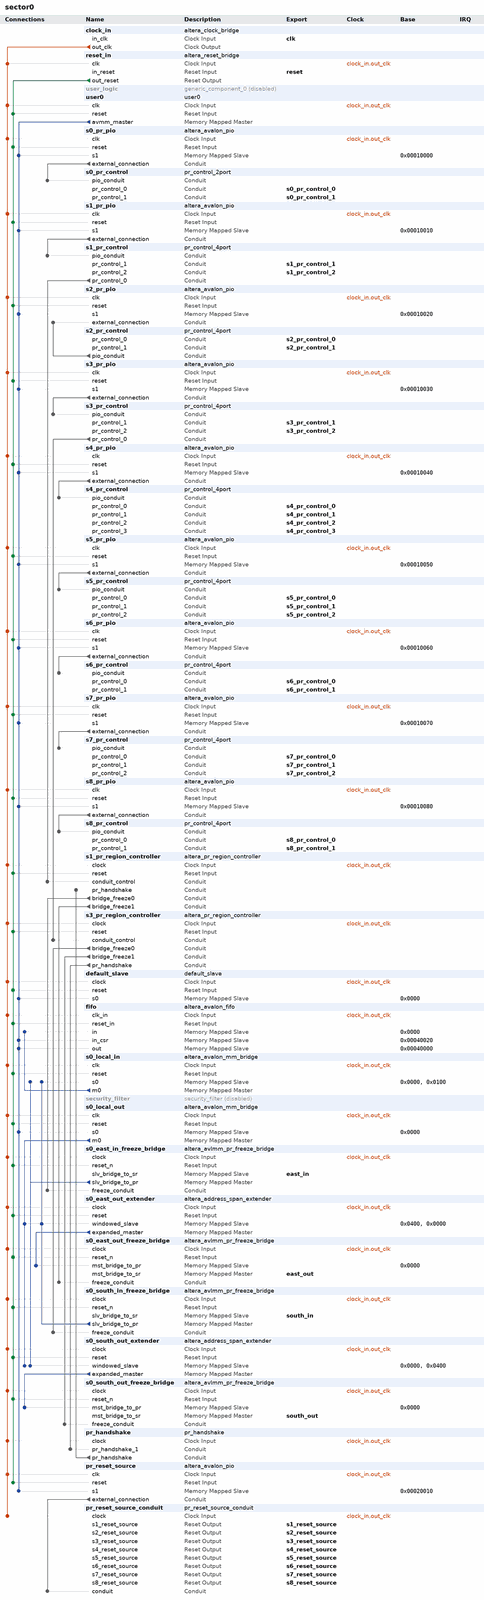
[diagram p0: system contents, whole]
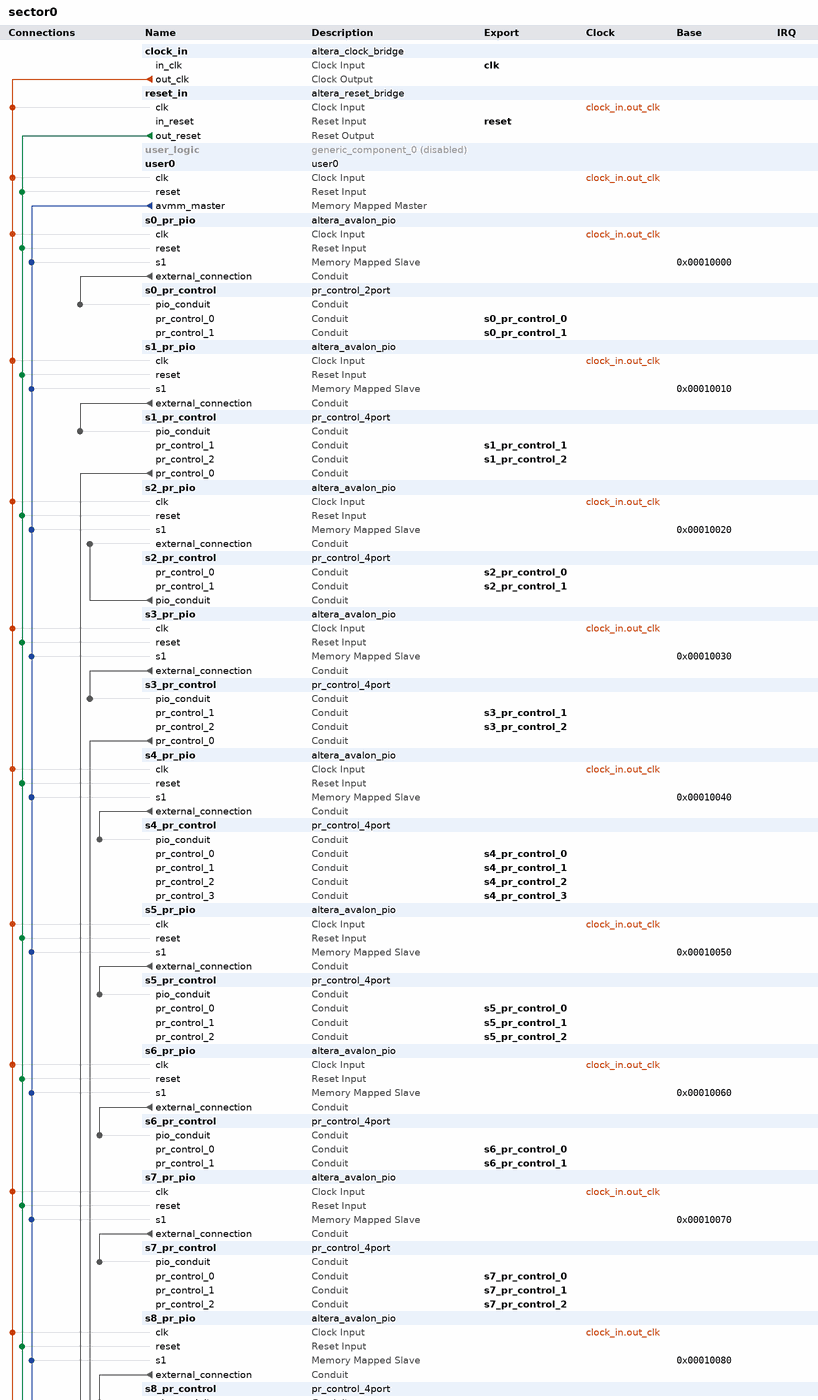
[diagram p1: system contents, upper part]
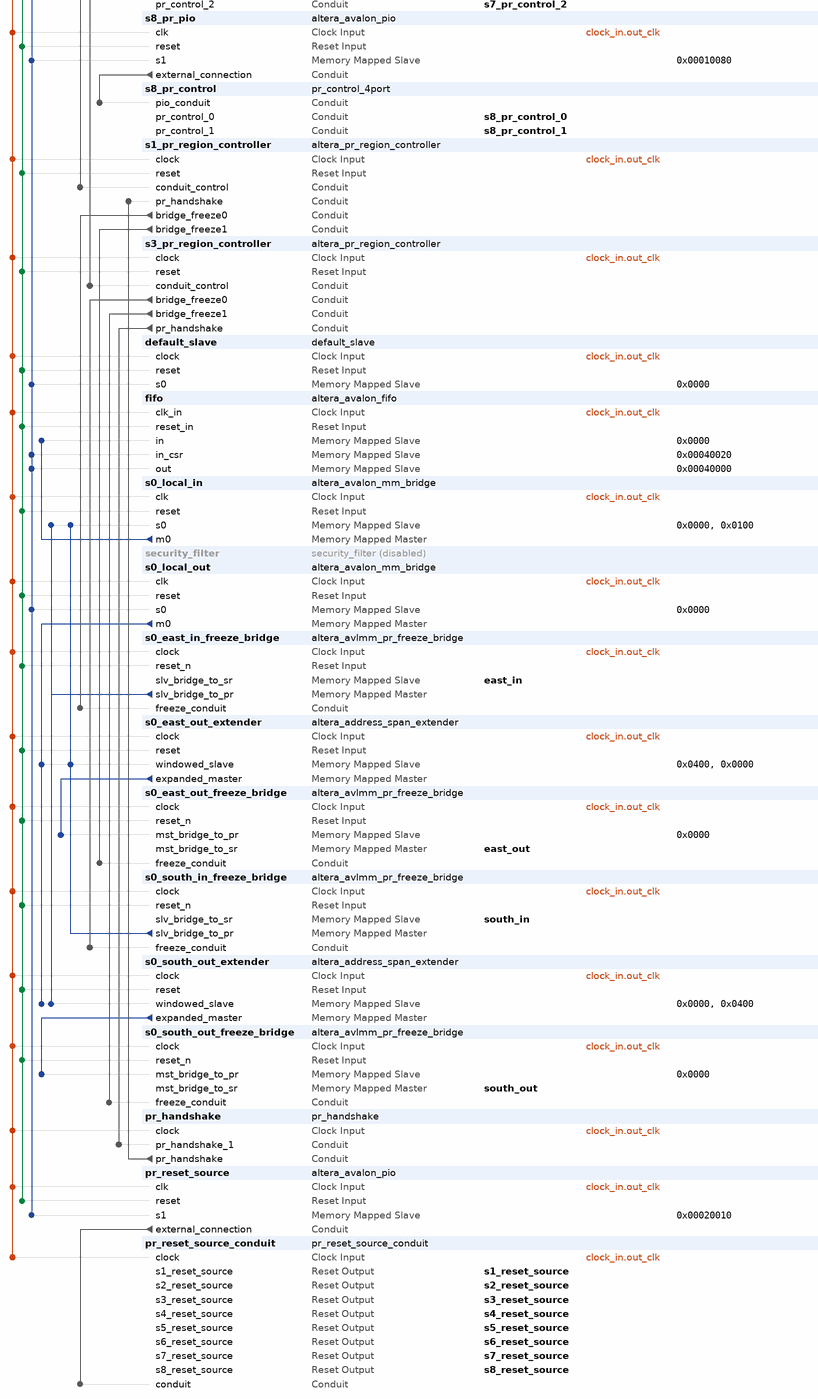
[diagram p2: system contents, lower part]
# Platform Designer (Qsys) system sector0, Stratix 10 1SG280HU2F50E2VGS1
# Parameters at their usual value, and those the tool derives, are not listed.
package require -exact qsys 1.0
create_system sector0
set_project_property DEVICE_FAMILY {Stratix 10}
set_project_property DEVICE 1SG280HU2F50E2VGS1

add_component clock_in ip/sector0/sector0_clock_in.ip altera_clock_bridge clock_in 18.0
load_component clock_in
set_component_parameter_value DERIVED_CLOCK_RATE 50000000
set_component_parameter_value EXPLICIT_CLOCK_RATE 50000000
save_component

add_component reset_in ip/sector0/sector0_reset_in.ip altera_reset_bridge reset_in 18.0
load_component reset_in
set_component_parameter_value ACTIVE_LOW_RESET 0
set_component_parameter_value SYNCHRONOUS_EDGES deassert
set_component_parameter_value SYNC_RESET 0
save_component

add_component user_logic {} generic_component_0 user_logic 1.0
set_instance_property user_logic ENABLED false

add_component user0 user0.qsys user0 user0 

add_component s0_pr_pio ip/sector0/sector0_pio_0.ip altera_avalon_pio s0_pr_pio 18.0
load_component s0_pr_pio
set_component_parameter_value direction InOut
set_component_parameter_value width 8
save_component

add_component s0_pr_control ip/sector0/sector0_pr_control_2port_0.ip pr_control_2port s0_pr_control 1.0

add_component s1_pr_pio ip/sector0/sector0_pio_1.ip altera_avalon_pio s1_pr_pio 18.0
load_component s1_pr_pio
set_component_parameter_value direction InOut
set_component_parameter_value width 16
save_component

add_component s1_pr_control ip/sector0/sector0_pr_control_4port_2.ip pr_control_4port s1_pr_control 1.0

add_component s2_pr_pio ip/sector0/sector0_pio_2.ip altera_avalon_pio s2_pr_pio 18.0
load_component s2_pr_pio
set_component_parameter_value direction InOut
set_component_parameter_value width 16
save_component

add_component s2_pr_control ip/sector0/sector0_pr_control_4port_3.ip pr_control_4port s2_pr_control 1.0

add_component s3_pr_pio ip/sector0/sector0_pio_3.ip altera_avalon_pio s3_pr_pio 18.0
load_component s3_pr_pio
set_component_parameter_value direction InOut
set_component_parameter_value width 16
save_component

add_component s3_pr_control ip/sector0/sector0_pr_control_4port_1.ip pr_control_4port s3_pr_control 1.0

add_component s4_pr_pio ip/sector0/sector0_pio_4.ip altera_avalon_pio s4_pr_pio 18.0
load_component s4_pr_pio
set_component_parameter_value direction InOut
set_component_parameter_value width 16
save_component

add_component s4_pr_control ip/sector0/sector0_pr_control_4port_0.ip pr_control_4port s4_pr_control 1.0

add_component s5_pr_pio ip/sector0/sector0_pio_5.ip altera_avalon_pio s5_pr_pio 18.0
load_component s5_pr_pio
set_component_parameter_value direction InOut
set_component_parameter_value width 16
save_component

add_component s5_pr_control ip/sector0/sector0_pr_control_4port_4.ip pr_control_4port s5_pr_control 1.0

add_component s6_pr_pio ip/sector0/sector0_pio_6.ip altera_avalon_pio s6_pr_pio 18.0
load_component s6_pr_pio
set_component_parameter_value direction InOut
set_component_parameter_value width 16
save_component

add_component s6_pr_control ip/sector0/sector0_pr_control_4port_5.ip pr_control_4port s6_pr_control 1.0

add_component s7_pr_pio ip/sector0/sector0_pio_7.ip altera_avalon_pio s7_pr_pio 18.0
load_component s7_pr_pio
set_component_parameter_value direction InOut
set_component_parameter_value width 16
save_component

add_component s7_pr_control ip/sector0/sector0_pr_control_4port_6.ip pr_control_4port s7_pr_control 1.0

add_component s8_pr_pio ip/sector0/sector0_pio_8.ip altera_avalon_pio s8_pr_pio 18.0
load_component s8_pr_pio
set_component_parameter_value direction InOut
set_component_parameter_value width 16
save_component

add_component s8_pr_control ip/sector0/sector0_pr_control_4port_7.ip pr_control_4port s8_pr_control 1.0

add_component s1_pr_region_controller ip/sector0/sector0_pr_region_controller_0.ip altera_pr_region_controller s1_pr_region_controller 18.0
load_component s1_pr_region_controller
set_component_parameter_value ENABLE_CSR false
set_component_parameter_value ENABLE_IRQ false
set_component_parameter_value NUM_INTF_BRIDGE 2
set_component_parameter_value ENABLE_PR_REGION_FREEZE false
set_component_parameter_value NUM_PR_REGION_RAM 1
save_component

add_component s3_pr_region_controller ip/sector0/sector0_pr_region_controller_1.ip altera_pr_region_controller s3_pr_region_controller 18.0
load_component s3_pr_region_controller
set_component_parameter_value ENABLE_CSR false
set_component_parameter_value ENABLE_IRQ false
set_component_parameter_value NUM_INTF_BRIDGE 2
set_component_parameter_value ENABLE_PR_REGION_FREEZE false
set_component_parameter_value NUM_PR_REGION_RAM 1
save_component

add_component default_slave ip/sector0/sector0_default_slave_0.ip default_slave default_slave 1.0

add_component fifo ip/sector0/sector0_fifo_0.ip altera_avalon_fifo fifo 18.0
load_component fifo
set_component_parameter_value bitsPerSymbol 16
set_component_parameter_value channelWidth 8
set_component_parameter_value errorWidth 8
set_component_parameter_value fifoDepth 16
set_component_parameter_value fifoInputInterfaceOptions AVALONMM_WRITE
set_component_parameter_value fifoOutputInterfaceOptions AVALONMM_READ
set_component_parameter_value singleClockMode true
set_component_parameter_value symbolsPerBeat 2
set_component_parameter_value useIRQ false
set_component_parameter_value usePacket true
set_component_parameter_value useReadControl false
save_component

add_component s0_local_in ip/sector0/s0_local_in.ip altera_avalon_mm_bridge s0_local_in 18.0
load_component s0_local_in
set_component_parameter_value DATA_WIDTH 32
set_component_parameter_value ADDRESS_WIDTH 4
set_component_parameter_value USE_AUTO_ADDRESS_WIDTH 0
set_component_parameter_value ADDRESS_UNITS SYMBOLS
set_component_parameter_value MAX_PENDING_RESPONSES 4
set_component_parameter_value SYNC_RESET 0
save_component

add_component security_filter ip/sector0/sector0_security_filter_0.ip security_filter security_filter 0
load_component security_filter
set_instance_property security_filter ENABLED false
set_component_parameter_value SECTOR_ADDR_SIZE 4
set_component_parameter_value AVMM_ADDR_SIZE 16
set_component_parameter_value DATA_SIZE 32
set_component_parameter_value DROP_ADDR 255
set_component_parameter_value S0_ADDR 255
set_component_parameter_value S1_ADDR 32768
set_component_parameter_value S2_ADDR 36864
set_component_parameter_value S3_ADDR 24576
set_component_parameter_value S4_ADDR 16384
set_component_parameter_value S5_ADDR 20480
set_component_parameter_value S6_ADDR 0
set_component_parameter_value S7_ADDR 8192
set_component_parameter_value S8_ADDR 12288
save_component

add_component s0_local_out ip/sector0/s0_local_out.ip altera_avalon_mm_bridge s0_local_out 18.0
load_component s0_local_out
set_component_parameter_value DATA_WIDTH 32
set_component_parameter_value ADDRESS_WIDTH 16
set_component_parameter_value USE_AUTO_ADDRESS_WIDTH 0
set_component_parameter_value ADDRESS_UNITS SYMBOLS
set_component_parameter_value MAX_PENDING_RESPONSES 4
set_component_parameter_value SYNC_RESET 0
save_component

add_component s0_east_in_freeze_bridge ip/sector0/sector0_avlmm_pr_freeze_bridge_0.ip altera_avlmm_pr_freeze_bridge s0_east_in_freeze_bridge 18.0
load_component s0_east_in_freeze_bridge
set_component_parameter_value Interface_Type {Avalon-MM Slave}
set_component_parameter_value ENABLE_FREEZE_FROM_PR_REGION false
set_component_parameter_value ENABLE_TRAFFIC_TRACKING false
set_component_parameter_value slv_bridge_signal_name_DERIVED address,beginbursttransfer,byteenable,debugaccess,read,write,readdata,writedata,waitrequest,readdatavalid,burstcount,response,lock,writeresponsevalid
set_component_parameter_value slv_bridge_signal_Enable Yes,No,Yes,No,Yes,Yes,Yes,Yes,Yes,Yes,No,No,No,No
set_component_parameter_value SLV_BRIDGE_ADDR_WIDTH 20
set_component_parameter_value SLV_BRIDGE_SYMBOL_WIDTH 8
set_component_parameter_value SLV_BRIDGE_BYTEEN_WIDTH 4
set_component_parameter_value SLV_BRIDGE_BURSTCOUNT_WIDTH 3
set_component_parameter_value SLV_BRIDGE_BURST_LINEWRAP false
set_component_parameter_value SLV_BRIDGE_CONSTANTBURSTBEHAVIOR false
set_component_parameter_value SLV_BRIDGE_BURST_BNDR_ONLY false
set_component_parameter_value SLV_BRIDGE_MAX_PENDING_READS 1
set_component_parameter_value SLV_BRIDGE_MAX_PENDING_WRITES 0
set_component_parameter_value SLV_BRIDGE_FIX_READ_LATENCY 0
set_component_parameter_value SLV_BRIDGE_READ_WAIT_TIME 1
set_component_parameter_value SLV_BRIDGE_WRITE_WAIT_TIME 0
set_component_parameter_value SLV_BRIDGE_ADDRESS_UNITS SYMBOLS
set_component_parameter_value mst_bridge_signal_name_DERIVED address,beginbursttransfer,byteenable,debugaccess,read,write,readdata,writedata,waitrequest,readdatavalid,burstcount,response,lock,writeresponsevalid
set_component_parameter_value mst_bridge_signal_Enable Yes,Yes,Yes,Yes,Yes,Yes,Yes,Yes,Yes,Yes,Yes,Yes,Yes,Yes
set_component_parameter_value MST_BRIDGE_ADDR_WIDTH 32
set_component_parameter_value MST_BRIDGE_SYMBOL_WIDTH 8
set_component_parameter_value MST_BRIDGE_BYTEEN_WIDTH 4
set_component_parameter_value MST_BRIDGE_BURSTCOUNT_WIDTH 3
set_component_parameter_value MST_BRIDGE_BURST_LINEWRAP true
set_component_parameter_value MST_BRIDGE_BURST_BNDR_ONLY true
set_component_parameter_value MST_BRIDGE_CONSTANTBURSTBEHAVIOR true
set_component_parameter_value MST_BRIDGE_MAX_PENDING_READS 1
set_component_parameter_value MST_BRIDGE_MAX_PENDING_WRITES 1
set_component_parameter_value MST_BRIDGE_FIX_READ_LATENCY 0
set_component_parameter_value MST_BRIDGE_READ_WAIT_TIME 1
set_component_parameter_value MST_BRIDGE_WRITE_WAIT_TIME 0
set_component_parameter_value MST_BRIDGE_ADDRESS_UNITS SYMBOLS
save_component

add_component s0_east_out_extender ip/sector0/s0_east_out_extender.ip altera_address_span_extender s0_east_out_extender 18.0
load_component s0_east_out_extender
set_component_parameter_value DATA_WIDTH 32
set_component_parameter_value MASTER_ADDRESS_WIDTH 20
set_component_parameter_value SLAVE_ADDRESS_WIDTH 6
set_component_parameter_value BURSTCOUNT_WIDTH 1
set_component_parameter_value MASTER_ADDRESS_DEF 0
set_component_parameter_value ENABLE_SLAVE_PORT false
set_component_parameter_value MAX_PENDING_READS 4
set_component_parameter_value SYNC_RESET 0
save_component

add_component s0_east_out_freeze_bridge ip/sector0/sector0_avlmm_pr_freeze_bridge_1.ip altera_avlmm_pr_freeze_bridge s0_east_out_freeze_bridge 18.0
load_component s0_east_out_freeze_bridge
set_component_parameter_value Interface_Type {Avalon-MM Master}
set_component_parameter_value ENABLE_FREEZE_FROM_PR_REGION false
set_component_parameter_value ENABLE_TRAFFIC_TRACKING false
set_component_parameter_value slv_bridge_signal_name_DERIVED address,beginbursttransfer,byteenable,debugaccess,read,write,readdata,writedata,waitrequest,readdatavalid,burstcount,response,lock,writeresponsevalid
set_component_parameter_value slv_bridge_signal_Enable Yes,Yes,Yes,Yes,Yes,Yes,Yes,Yes,Yes,Yes,Yes,Yes,Yes,Yes
set_component_parameter_value SLV_BRIDGE_ADDR_WIDTH 32
set_component_parameter_value SLV_BRIDGE_SYMBOL_WIDTH 8
set_component_parameter_value SLV_BRIDGE_BYTEEN_WIDTH 4
set_component_parameter_value SLV_BRIDGE_BURSTCOUNT_WIDTH 3
set_component_parameter_value SLV_BRIDGE_BURST_LINEWRAP true
set_component_parameter_value SLV_BRIDGE_CONSTANTBURSTBEHAVIOR true
set_component_parameter_value SLV_BRIDGE_BURST_BNDR_ONLY true
set_component_parameter_value SLV_BRIDGE_MAX_PENDING_READS 1
set_component_parameter_value SLV_BRIDGE_MAX_PENDING_WRITES 1
set_component_parameter_value SLV_BRIDGE_FIX_READ_LATENCY 0
set_component_parameter_value SLV_BRIDGE_READ_WAIT_TIME 1
set_component_parameter_value SLV_BRIDGE_WRITE_WAIT_TIME 0
set_component_parameter_value SLV_BRIDGE_ADDRESS_UNITS SYMBOLS
set_component_parameter_value mst_bridge_signal_name_DERIVED address,beginbursttransfer,byteenable,debugaccess,read,write,readdata,writedata,waitrequest,readdatavalid,burstcount,response,lock,writeresponsevalid
set_component_parameter_value mst_bridge_signal_Enable Yes,No,Yes,No,Yes,Yes,Yes,Yes,Yes,Yes,No,No,No,No
set_component_parameter_value MST_BRIDGE_ADDR_WIDTH 20
set_component_parameter_value MST_BRIDGE_SYMBOL_WIDTH 8
set_component_parameter_value MST_BRIDGE_BYTEEN_WIDTH 4
set_component_parameter_value MST_BRIDGE_BURSTCOUNT_WIDTH 3
set_component_parameter_value MST_BRIDGE_BURST_LINEWRAP false
set_component_parameter_value MST_BRIDGE_BURST_BNDR_ONLY false
set_component_parameter_value MST_BRIDGE_CONSTANTBURSTBEHAVIOR false
set_component_parameter_value MST_BRIDGE_MAX_PENDING_READS 1
set_component_parameter_value MST_BRIDGE_MAX_PENDING_WRITES 0
set_component_parameter_value MST_BRIDGE_FIX_READ_LATENCY 0
set_component_parameter_value MST_BRIDGE_READ_WAIT_TIME 1
set_component_parameter_value MST_BRIDGE_WRITE_WAIT_TIME 0
set_component_parameter_value MST_BRIDGE_ADDRESS_UNITS SYMBOLS
save_component

add_component s0_south_in_freeze_bridge ip/sector0/sector0_avlmm_pr_freeze_bridge_2.ip altera_avlmm_pr_freeze_bridge s0_south_in_freeze_bridge 18.0
load_component s0_south_in_freeze_bridge
set_component_parameter_value Interface_Type {Avalon-MM Slave}
set_component_parameter_value ENABLE_FREEZE_FROM_PR_REGION false
set_component_parameter_value ENABLE_TRAFFIC_TRACKING false
set_component_parameter_value slv_bridge_signal_name_DERIVED address,beginbursttransfer,byteenable,debugaccess,read,write,readdata,writedata,waitrequest,readdatavalid,burstcount,response,lock,writeresponsevalid
set_component_parameter_value slv_bridge_signal_Enable Yes,No,Yes,No,Yes,Yes,Yes,Yes,Yes,Yes,No,No,No,No
set_component_parameter_value SLV_BRIDGE_ADDR_WIDTH 20
set_component_parameter_value SLV_BRIDGE_SYMBOL_WIDTH 8
set_component_parameter_value SLV_BRIDGE_BYTEEN_WIDTH 4
set_component_parameter_value SLV_BRIDGE_BURSTCOUNT_WIDTH 3
set_component_parameter_value SLV_BRIDGE_BURST_LINEWRAP false
set_component_parameter_value SLV_BRIDGE_CONSTANTBURSTBEHAVIOR false
set_component_parameter_value SLV_BRIDGE_BURST_BNDR_ONLY false
set_component_parameter_value SLV_BRIDGE_MAX_PENDING_READS 1
set_component_parameter_value SLV_BRIDGE_MAX_PENDING_WRITES 0
set_component_parameter_value SLV_BRIDGE_FIX_READ_LATENCY 0
set_component_parameter_value SLV_BRIDGE_READ_WAIT_TIME 1
set_component_parameter_value SLV_BRIDGE_WRITE_WAIT_TIME 0
set_component_parameter_value SLV_BRIDGE_ADDRESS_UNITS SYMBOLS
set_component_parameter_value mst_bridge_signal_name_DERIVED address,beginbursttransfer,byteenable,debugaccess,read,write,readdata,writedata,waitrequest,readdatavalid,burstcount,response,lock,writeresponsevalid
set_component_parameter_value mst_bridge_signal_Enable Yes,Yes,Yes,Yes,Yes,Yes,Yes,Yes,Yes,Yes,Yes,Yes,Yes,Yes
set_component_parameter_value MST_BRIDGE_ADDR_WIDTH 32
set_component_parameter_value MST_BRIDGE_SYMBOL_WIDTH 8
set_component_parameter_value MST_BRIDGE_BYTEEN_WIDTH 4
set_component_parameter_value MST_BRIDGE_BURSTCOUNT_WIDTH 3
set_component_parameter_value MST_BRIDGE_BURST_LINEWRAP true
set_component_parameter_value MST_BRIDGE_BURST_BNDR_ONLY true
set_component_parameter_value MST_BRIDGE_CONSTANTBURSTBEHAVIOR true
set_component_parameter_value MST_BRIDGE_MAX_PENDING_READS 1
set_component_parameter_value MST_BRIDGE_MAX_PENDING_WRITES 1
set_component_parameter_value MST_BRIDGE_FIX_READ_LATENCY 0
set_component_parameter_value MST_BRIDGE_READ_WAIT_TIME 1
set_component_parameter_value MST_BRIDGE_WRITE_WAIT_TIME 0
set_component_parameter_value MST_BRIDGE_ADDRESS_UNITS SYMBOLS
save_component

add_component s0_south_out_extender ip/sector0/s0_south_out_extender.ip altera_address_span_extender s0_south_out_extender 18.0
load_component s0_south_out_extender
set_component_parameter_value DATA_WIDTH 32
set_component_parameter_value MASTER_ADDRESS_WIDTH 20
set_component_parameter_value SLAVE_ADDRESS_WIDTH 8
set_component_parameter_value BURSTCOUNT_WIDTH 1
set_component_parameter_value MASTER_ADDRESS_DEF 0
set_component_parameter_value ENABLE_SLAVE_PORT false
set_component_parameter_value MAX_PENDING_READS 4
set_component_parameter_value SYNC_RESET 0
save_component

add_component s0_south_out_freeze_bridge ip/sector0/sector0_avlmm_pr_freeze_bridge_3.ip altera_avlmm_pr_freeze_bridge s0_south_out_freeze_bridge 18.0
load_component s0_south_out_freeze_bridge
set_component_parameter_value Interface_Type {Avalon-MM Master}
set_component_parameter_value ENABLE_FREEZE_FROM_PR_REGION false
set_component_parameter_value ENABLE_TRAFFIC_TRACKING false
set_component_parameter_value slv_bridge_signal_name_DERIVED address,beginbursttransfer,byteenable,debugaccess,read,write,readdata,writedata,waitrequest,readdatavalid,burstcount,response,lock,writeresponsevalid
set_component_parameter_value slv_bridge_signal_Enable Yes,Yes,Yes,Yes,Yes,Yes,Yes,Yes,Yes,Yes,Yes,Yes,Yes,Yes
set_component_parameter_value SLV_BRIDGE_ADDR_WIDTH 32
set_component_parameter_value SLV_BRIDGE_SYMBOL_WIDTH 8
set_component_parameter_value SLV_BRIDGE_BYTEEN_WIDTH 4
set_component_parameter_value SLV_BRIDGE_BURSTCOUNT_WIDTH 3
set_component_parameter_value SLV_BRIDGE_BURST_LINEWRAP true
set_component_parameter_value SLV_BRIDGE_CONSTANTBURSTBEHAVIOR true
set_component_parameter_value SLV_BRIDGE_BURST_BNDR_ONLY true
set_component_parameter_value SLV_BRIDGE_MAX_PENDING_READS 1
set_component_parameter_value SLV_BRIDGE_MAX_PENDING_WRITES 1
set_component_parameter_value SLV_BRIDGE_FIX_READ_LATENCY 0
set_component_parameter_value SLV_BRIDGE_READ_WAIT_TIME 1
set_component_parameter_value SLV_BRIDGE_WRITE_WAIT_TIME 0
set_component_parameter_value SLV_BRIDGE_ADDRESS_UNITS SYMBOLS
set_component_parameter_value mst_bridge_signal_name_DERIVED address,beginbursttransfer,byteenable,debugaccess,read,write,readdata,writedata,waitrequest,readdatavalid,burstcount,response,lock,writeresponsevalid
set_component_parameter_value mst_bridge_signal_Enable Yes,No,Yes,No,Yes,Yes,Yes,Yes,Yes,Yes,No,No,No,No
set_component_parameter_value MST_BRIDGE_ADDR_WIDTH 20
set_component_parameter_value MST_BRIDGE_SYMBOL_WIDTH 8
set_component_parameter_value MST_BRIDGE_BYTEEN_WIDTH 4
set_component_parameter_value MST_BRIDGE_BURSTCOUNT_WIDTH 3
set_component_parameter_value MST_BRIDGE_BURST_LINEWRAP false
set_component_parameter_value MST_BRIDGE_BURST_BNDR_ONLY false
set_component_parameter_value MST_BRIDGE_CONSTANTBURSTBEHAVIOR false
set_component_parameter_value MST_BRIDGE_MAX_PENDING_READS 1
set_component_parameter_value MST_BRIDGE_MAX_PENDING_WRITES 0
set_component_parameter_value MST_BRIDGE_FIX_READ_LATENCY 0
set_component_parameter_value MST_BRIDGE_READ_WAIT_TIME 1
set_component_parameter_value MST_BRIDGE_WRITE_WAIT_TIME 0
set_component_parameter_value MST_BRIDGE_ADDRESS_UNITS SYMBOLS
save_component

add_component pr_handshake ip/sector0/sector0_pr_handshake_0.ip pr_handshake pr_handshake 1.0

add_component pr_reset_source ip/sector0/sector0_pio_9.ip altera_avalon_pio pr_reset_source 18.0
load_component pr_reset_source
set_component_parameter_value direction Output
set_component_parameter_value width 9
save_component

add_component pr_reset_source_conduit ip/sector0/sector0_pr_reset_source_conduit_0.ip pr_reset_source_conduit pr_reset_source_conduit 1.0

# connections
add_connection clock_in.out_clk default_slave.clock clock
add_connection clock_in.out_clk fifo.clk_in clock
add_connection clock_in.out_clk pr_handshake.clock clock
add_connection clock_in.out_clk pr_reset_source.clk clock
add_connection clock_in.out_clk pr_reset_source_conduit.clock clock
add_connection clock_in.out_clk reset_in.clk clock
add_connection clock_in.out_clk s0_east_in_freeze_bridge.clock clock
add_connection clock_in.out_clk s0_east_out_extender.clock clock
add_connection clock_in.out_clk s0_east_out_freeze_bridge.clock clock
add_connection clock_in.out_clk s0_local_in.clk clock
add_connection clock_in.out_clk s0_local_out.clk clock
add_connection clock_in.out_clk s0_pr_pio.clk clock
add_connection clock_in.out_clk s0_south_in_freeze_bridge.clock clock
add_connection clock_in.out_clk s0_south_out_extender.clock clock
add_connection clock_in.out_clk s0_south_out_freeze_bridge.clock clock
add_connection clock_in.out_clk s1_pr_pio.clk clock
add_connection clock_in.out_clk s1_pr_region_controller.clock clock
add_connection clock_in.out_clk s2_pr_pio.clk clock
add_connection clock_in.out_clk s3_pr_pio.clk clock
add_connection clock_in.out_clk s3_pr_region_controller.clock clock
add_connection clock_in.out_clk s4_pr_pio.clk clock
add_connection clock_in.out_clk s5_pr_pio.clk clock
add_connection clock_in.out_clk s6_pr_pio.clk clock
add_connection clock_in.out_clk s7_pr_pio.clk clock
add_connection clock_in.out_clk s8_pr_pio.clk clock
add_connection clock_in.out_clk user0.clk clock
add_connection reset_in.out_reset default_slave.reset reset
add_connection reset_in.out_reset fifo.reset_in reset
add_connection reset_in.out_reset pr_reset_source.reset reset
add_connection reset_in.out_reset s0_east_in_freeze_bridge.reset_n reset
add_connection reset_in.out_reset s0_east_out_extender.reset reset
add_connection reset_in.out_reset s0_east_out_freeze_bridge.reset_n reset
add_connection reset_in.out_reset s0_local_in.reset reset
add_connection reset_in.out_reset s0_local_out.reset reset
add_connection reset_in.out_reset s0_pr_pio.reset reset
add_connection reset_in.out_reset s0_south_in_freeze_bridge.reset_n reset
add_connection reset_in.out_reset s0_south_out_extender.reset reset
add_connection reset_in.out_reset s0_south_out_freeze_bridge.reset_n reset
add_connection reset_in.out_reset s1_pr_pio.reset reset
add_connection reset_in.out_reset s1_pr_region_controller.reset reset
add_connection reset_in.out_reset s2_pr_pio.reset reset
add_connection reset_in.out_reset s3_pr_pio.reset reset
add_connection reset_in.out_reset s3_pr_region_controller.reset reset
add_connection reset_in.out_reset s4_pr_pio.reset reset
add_connection reset_in.out_reset s5_pr_pio.reset reset
add_connection reset_in.out_reset s6_pr_pio.reset reset
add_connection reset_in.out_reset s7_pr_pio.reset reset
add_connection reset_in.out_reset s8_pr_pio.reset reset
add_connection reset_in.out_reset user0.reset reset
add_connection s0_east_in_freeze_bridge.slv_bridge_to_pr s0_local_in.s0 avalon
set_connection_parameter_value s0_east_in_freeze_bridge.slv_bridge_to_pr/s0_local_in.s0 baseAddress 0x0000
add_connection s0_east_in_freeze_bridge.slv_bridge_to_pr s0_south_out_extender.windowed_slave avalon
set_connection_parameter_value s0_east_in_freeze_bridge.slv_bridge_to_pr/s0_south_out_extender.windowed_slave baseAddress 0x0400
add_connection s0_east_out_extender.expanded_master s0_east_out_freeze_bridge.mst_bridge_to_pr avalon
set_connection_parameter_value s0_east_out_extender.expanded_master/s0_east_out_freeze_bridge.mst_bridge_to_pr baseAddress 0x0000
add_connection s0_local_in.m0 fifo.in avalon
set_connection_parameter_value s0_local_in.m0/fifo.in baseAddress 0x0000
add_connection s0_local_out.m0 s0_east_out_extender.windowed_slave avalon
set_connection_parameter_value s0_local_out.m0/s0_east_out_extender.windowed_slave baseAddress 0x0400
add_connection s0_local_out.m0 s0_south_out_extender.windowed_slave avalon
set_connection_parameter_value s0_local_out.m0/s0_south_out_extender.windowed_slave baseAddress 0x0000
add_connection s0_south_in_freeze_bridge.slv_bridge_to_pr s0_east_out_extender.windowed_slave avalon
set_connection_parameter_value s0_south_in_freeze_bridge.slv_bridge_to_pr/s0_east_out_extender.windowed_slave baseAddress 0x0000
add_connection s0_south_in_freeze_bridge.slv_bridge_to_pr s0_local_in.s0 avalon
set_connection_parameter_value s0_south_in_freeze_bridge.slv_bridge_to_pr/s0_local_in.s0 baseAddress 0x0100
add_connection s0_south_out_extender.expanded_master s0_south_out_freeze_bridge.mst_bridge_to_pr avalon
set_connection_parameter_value s0_south_out_extender.expanded_master/s0_south_out_freeze_bridge.mst_bridge_to_pr baseAddress 0x0000
add_connection user0.avmm_master default_slave.s0 avalon
set_connection_parameter_value user0.avmm_master/default_slave.s0 baseAddress 0x0000
set_connection_parameter_value user0.avmm_master/default_slave.s0 defaultConnection true
add_connection user0.avmm_master fifo.in_csr avalon
set_connection_parameter_value user0.avmm_master/fifo.in_csr baseAddress 0x00040020
add_connection user0.avmm_master fifo.out avalon
set_connection_parameter_value user0.avmm_master/fifo.out baseAddress 0x00040000
add_connection user0.avmm_master pr_reset_source.s1 avalon
set_connection_parameter_value user0.avmm_master/pr_reset_source.s1 baseAddress 0x00020010
add_connection user0.avmm_master s0_local_out.s0 avalon
set_connection_parameter_value user0.avmm_master/s0_local_out.s0 baseAddress 0x0000
add_connection user0.avmm_master s0_pr_pio.s1 avalon
set_connection_parameter_value user0.avmm_master/s0_pr_pio.s1 baseAddress 0x00010000
add_connection user0.avmm_master s1_pr_pio.s1 avalon
set_connection_parameter_value user0.avmm_master/s1_pr_pio.s1 baseAddress 0x00010010
add_connection user0.avmm_master s2_pr_pio.s1 avalon
set_connection_parameter_value user0.avmm_master/s2_pr_pio.s1 baseAddress 0x00010020
add_connection user0.avmm_master s3_pr_pio.s1 avalon
set_connection_parameter_value user0.avmm_master/s3_pr_pio.s1 baseAddress 0x00010030
add_connection user0.avmm_master s4_pr_pio.s1 avalon
set_connection_parameter_value user0.avmm_master/s4_pr_pio.s1 baseAddress 0x00010040
add_connection user0.avmm_master s5_pr_pio.s1 avalon
set_connection_parameter_value user0.avmm_master/s5_pr_pio.s1 baseAddress 0x00010050
add_connection user0.avmm_master s6_pr_pio.s1 avalon
set_connection_parameter_value user0.avmm_master/s6_pr_pio.s1 baseAddress 0x00010060
add_connection user0.avmm_master s7_pr_pio.s1 avalon
set_connection_parameter_value user0.avmm_master/s7_pr_pio.s1 baseAddress 0x00010070
add_connection user0.avmm_master s8_pr_pio.s1 avalon
set_connection_parameter_value user0.avmm_master/s8_pr_pio.s1 baseAddress 0x00010080
add_connection pr_handshake.pr_handshake s1_pr_region_controller.pr_handshake conduit
add_connection pr_reset_source.external_connection pr_reset_source_conduit.conduit conduit
add_connection s0_pr_pio.external_connection s0_pr_control.pio_conduit conduit
add_connection s1_pr_control.pr_control_0 s1_pr_region_controller.conduit_control conduit
add_connection s1_pr_pio.external_connection s1_pr_control.pio_conduit conduit
add_connection s1_pr_region_controller.bridge_freeze0 s0_east_in_freeze_bridge.freeze_conduit conduit
add_connection s1_pr_region_controller.bridge_freeze1 s0_east_out_freeze_bridge.freeze_conduit conduit
add_connection s2_pr_control.pio_conduit s2_pr_pio.external_connection conduit
add_connection s3_pr_control.pr_control_0 s3_pr_region_controller.conduit_control conduit
add_connection s3_pr_pio.external_connection s3_pr_control.pio_conduit conduit
add_connection s3_pr_region_controller.bridge_freeze0 s0_south_in_freeze_bridge.freeze_conduit conduit
add_connection s3_pr_region_controller.bridge_freeze1 s0_south_out_freeze_bridge.freeze_conduit conduit
add_connection s3_pr_region_controller.pr_handshake pr_handshake.pr_handshake_1 conduit
add_connection s4_pr_pio.external_connection s4_pr_control.pio_conduit conduit
add_connection s5_pr_pio.external_connection s5_pr_control.pio_conduit conduit
add_connection s6_pr_pio.external_connection s6_pr_control.pio_conduit conduit
add_connection s7_pr_pio.external_connection s7_pr_control.pio_conduit conduit
add_connection s8_pr_pio.external_connection s8_pr_control.pio_conduit conduit

# exported interfaces
add_interface clk clock sink
set_interface_property clk EXPORT_OF clock_in.in_clk
add_interface east_in avalon slave
set_interface_property east_in EXPORT_OF s0_east_in_freeze_bridge.slv_bridge_to_sr
add_interface east_out avalon master
set_interface_property east_out EXPORT_OF s0_east_out_freeze_bridge.mst_bridge_to_sr
add_interface reset reset sink
set_interface_property reset EXPORT_OF reset_in.in_reset
add_interface s0_pr_control_0 conduit end
set_interface_property s0_pr_control_0 EXPORT_OF s0_pr_control.pr_control_0
add_interface s0_pr_control_1 conduit end
set_interface_property s0_pr_control_1 EXPORT_OF s0_pr_control.pr_control_1
add_interface s1_pr_control_1 conduit end
set_interface_property s1_pr_control_1 EXPORT_OF s1_pr_control.pr_control_1
add_interface s1_pr_control_2 conduit end
set_interface_property s1_pr_control_2 EXPORT_OF s1_pr_control.pr_control_2
add_interface s1_reset_source reset source
set_interface_property s1_reset_source EXPORT_OF pr_reset_source_conduit.s1_reset_source
add_interface s2_pr_control_0 conduit end
set_interface_property s2_pr_control_0 EXPORT_OF s2_pr_control.pr_control_0
add_interface s2_pr_control_1 conduit end
set_interface_property s2_pr_control_1 EXPORT_OF s2_pr_control.pr_control_1
add_interface s2_reset_source reset source
set_interface_property s2_reset_source EXPORT_OF pr_reset_source_conduit.s2_reset_source
add_interface s3_pr_control_1 conduit end
set_interface_property s3_pr_control_1 EXPORT_OF s3_pr_control.pr_control_1
add_interface s3_pr_control_2 conduit end
set_interface_property s3_pr_control_2 EXPORT_OF s3_pr_control.pr_control_2
add_interface s3_reset_source reset source
set_interface_property s3_reset_source EXPORT_OF pr_reset_source_conduit.s3_reset_source
add_interface s4_pr_control_0 conduit end
set_interface_property s4_pr_control_0 EXPORT_OF s4_pr_control.pr_control_0
add_interface s4_pr_control_1 conduit end
set_interface_property s4_pr_control_1 EXPORT_OF s4_pr_control.pr_control_1
add_interface s4_pr_control_2 conduit end
set_interface_property s4_pr_control_2 EXPORT_OF s4_pr_control.pr_control_2
add_interface s4_pr_control_3 conduit end
set_interface_property s4_pr_control_3 EXPORT_OF s4_pr_control.pr_control_3
add_interface s4_reset_source reset source
set_interface_property s4_reset_source EXPORT_OF pr_reset_source_conduit.s4_reset_source
add_interface s5_pr_control_0 conduit end
set_interface_property s5_pr_control_0 EXPORT_OF s5_pr_control.pr_control_0
add_interface s5_pr_control_1 conduit end
set_interface_property s5_pr_control_1 EXPORT_OF s5_pr_control.pr_control_1
add_interface s5_pr_control_2 conduit end
set_interface_property s5_pr_control_2 EXPORT_OF s5_pr_control.pr_control_2
add_interface s5_reset_source reset source
set_interface_property s5_reset_source EXPORT_OF pr_reset_source_conduit.s5_reset_source
add_interface s6_pr_control_0 conduit end
set_interface_property s6_pr_control_0 EXPORT_OF s6_pr_control.pr_control_0
add_interface s6_pr_control_1 conduit end
set_interface_property s6_pr_control_1 EXPORT_OF s6_pr_control.pr_control_1
add_interface s6_reset_source reset source
set_interface_property s6_reset_source EXPORT_OF pr_reset_source_conduit.s6_reset_source
add_interface s7_pr_control_0 conduit end
set_interface_property s7_pr_control_0 EXPORT_OF s7_pr_control.pr_control_0
add_interface s7_pr_control_1 conduit end
set_interface_property s7_pr_control_1 EXPORT_OF s7_pr_control.pr_control_1
add_interface s7_pr_control_2 conduit end
set_interface_property s7_pr_control_2 EXPORT_OF s7_pr_control.pr_control_2
add_interface s7_reset_source reset source
set_interface_property s7_reset_source EXPORT_OF pr_reset_source_conduit.s7_reset_source
add_interface s8_pr_control_0 conduit end
set_interface_property s8_pr_control_0 EXPORT_OF s8_pr_control.pr_control_0
add_interface s8_pr_control_1 conduit end
set_interface_property s8_pr_control_1 EXPORT_OF s8_pr_control.pr_control_1
add_interface s8_reset_source reset source
set_interface_property s8_reset_source EXPORT_OF pr_reset_source_conduit.s8_reset_source
add_interface south_in avalon slave
set_interface_property south_in EXPORT_OF s0_south_in_freeze_bridge.slv_bridge_to_sr
add_interface south_out avalon master
set_interface_property south_out EXPORT_OF s0_south_out_freeze_bridge.mst_bridge_to_sr

set_interconnect_requirement {$system} qsys_mm.clockCrossingAdapter HANDSHAKE
set_interconnect_requirement {$system} qsys_mm.enableEccProtection FALSE
set_interconnect_requirement {$system} qsys_mm.insertDefaultSlave FALSE
set_interconnect_requirement {$system} qsys_mm.maxAdditionalLatency 4

save_system sector0.qsys
